# EAGLE design schematic_K3_Tuner (EAGLE 6.5.0)
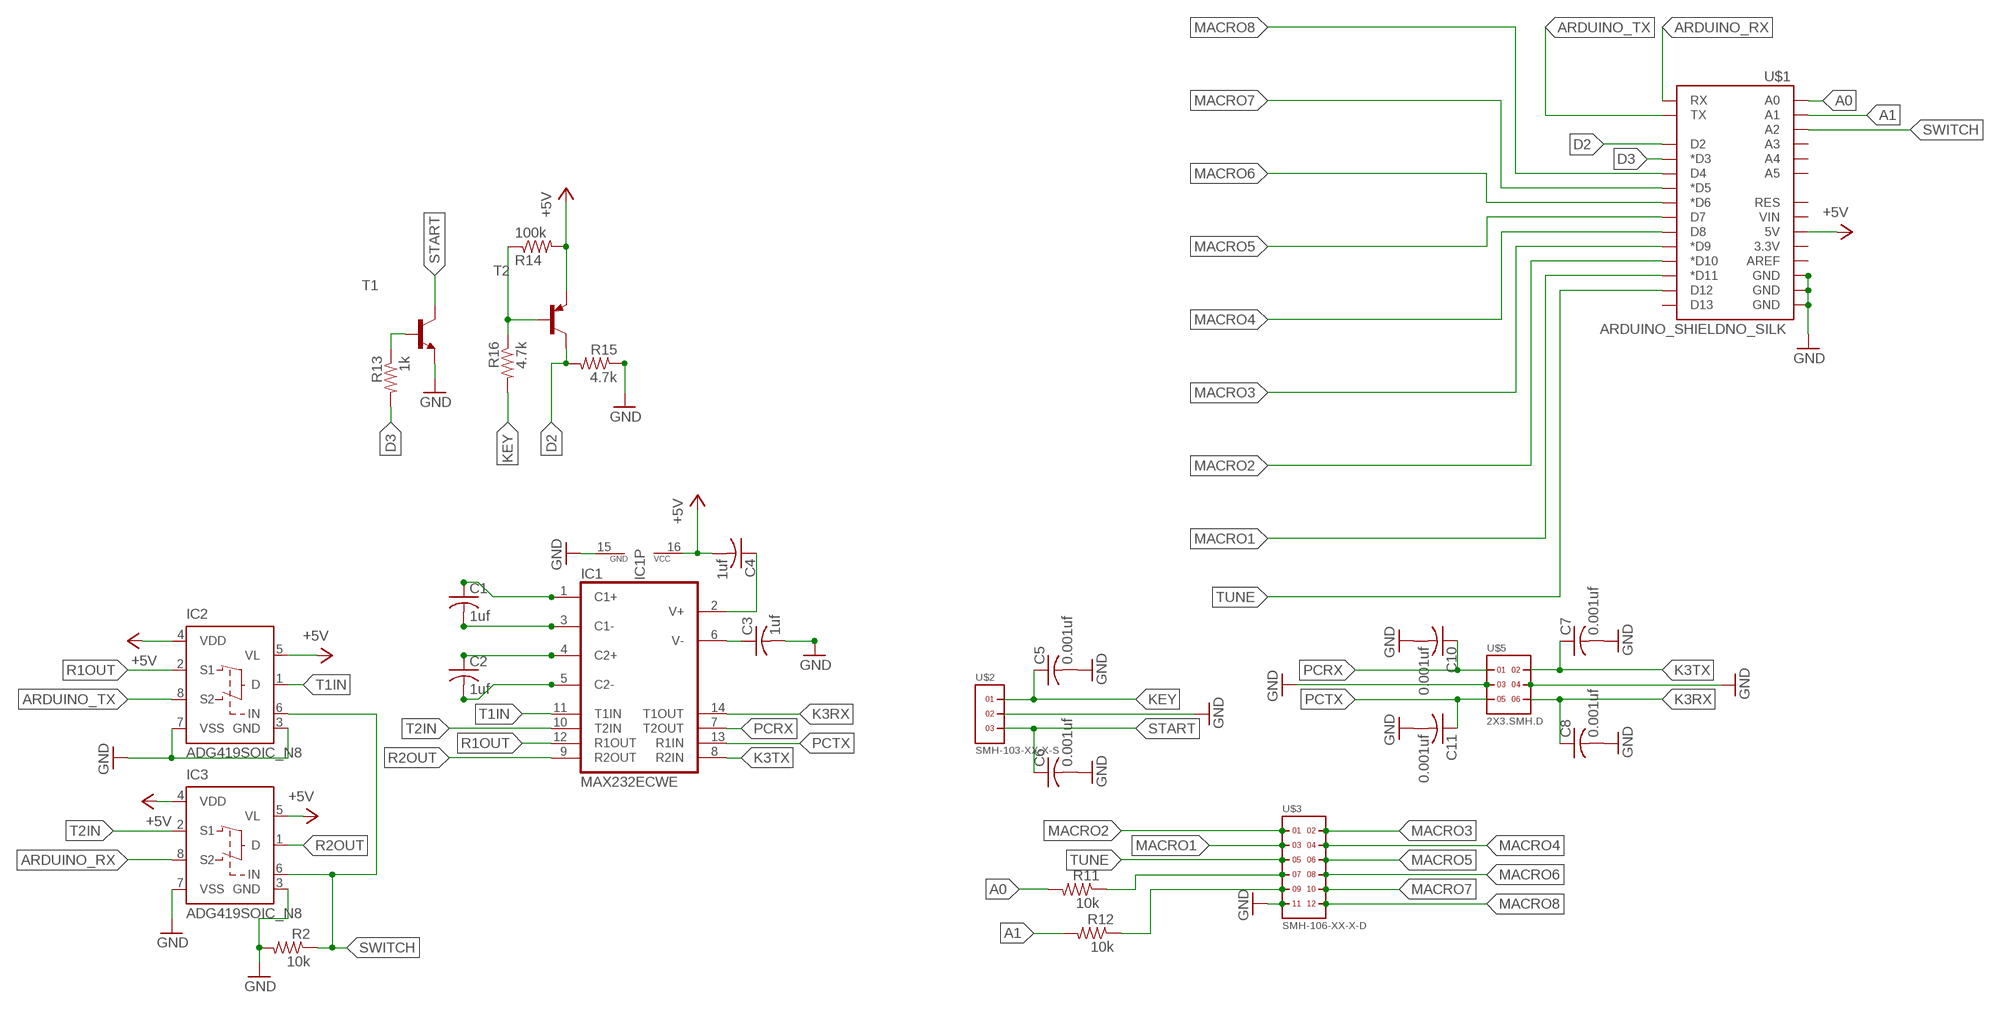
[diagram p0: schematic, sheet 1]

## Parts
C1  1uf  C-USC0805  [C0805]
C2  1uf  C-USC0805  [C0805]
C3  1uf  C-USC0805  [C0805]
C4  1uf  C-USC0805  [C0805]
C5  0.001uf  C-USC0805  [C0805]
C6  0.001uf  C-USC0805  [C0805]
C7  0.001uf  C-USC0805  [C0805]
C8  0.001uf  C-USC0805  [C0805]
C10  0.001uf  C-USC0805  [C0805]
C11  0.001uf  C-USC0805  [C0805]
IC1  MAX232ECWE  [SO16L]
IC2  ADG419SOIC_N8  [SOIC8]
IC3  ADG419SOIC_N8  [SOIC8]
R2  10k  R-US_M0805  [M0805]
R11  10k  R-US_M0805  [M0805]
R12  10k  R-US_M0805  [M0805]
R13  1k  R-US_M0805  [M0805]
R14  100k  R-US_M0805  [M0805]
R15  4.7k  R-US_M0805  [M0805]
R16  4.7k  R-US_M0805  [M0805]
T1  MMBT3904LT1-NPN-SOT23-BEC  [SOT23-BEC]
T2  MMBT3906LT1-PNP-SOT23-BEC  [SOT23-BEC]
U$1  ARDUINO_SHIELDNO_SILK  [DUEMILANOVE_VIAS]
U$2  SMH-103-XX-X-S  [SMH-103-XX-X-S]
U$3  SMH-106-XX-X-D  [SMH-106-XX-X-D]
U$5  2X3.SMH.D  [SMH-103-XX-X-D]

## Nets
+5V: C4.2 IC1.16(VCC) IC2.4(VDD) IC2.5(VL) IC3.4(VDD) IC3.5(VL) R14.2 T2.E U$1.5V
A0: R11.2 U$1.A0
A1: R12.2 U$1.A1
ARDUINO_RX: IC3.8(S2) U$1.RX
ARDUINO_TX: IC2.8(S2) U$1.TX
D2: R15.2 T2.C U$1.D2
D3: R13.2 U$1.D3(*D3)
GND: C3.2 C5.2 C6.2 C7.2 C8.2 C10.2 C11.2 IC1.15(GND) IC2.3(GND) IC2.7(VSS) IC3.3(GND) IC3.7(VSS) R2.2 R15.1 T1.E U$1.GND@0(GND) U$1.GND@1(GND) U$1.GND@2(GND) U$2.2 U$3.11 U$5.3 U$5.4
K3RX: C8.1 IC1.14(T1OUT) U$5.6
K3TX: C7.1 IC1.8(R2IN) U$5.2
KEY: C5.1 R16.2 U$2.1
MACRO1: U$1.D11(*D11) U$3.3
MACRO2: U$1.D10(*D10) U$3.1
MACRO3: U$1.D9(*D9) U$3.2
MACRO4: U$1.D8 U$3.4
MACRO5: U$1.D7 U$3.6
MACRO6: U$1.D6(*D6) U$3.8
MACRO7: U$1.D5(*D5) U$3.10
MACRO8: U$1.D4 U$3.12
N$1: R11.1 U$3.7
N$2: R12.1 U$3.9
N$3: C2.2 IC1.5(C2-)
N$4: C2.1 IC1.4(C2+)
N$6: C1.2 IC1.3(C1-)
N$7: C1.1 IC1.1(C1+)
N$9: C3.1 IC1.6(V-)
N$11: R13.1 T1.B
N$18: R14.1 R16.1 T2.B
N$19: C4.1 IC1.2(V+)
PCRX: C10.1 IC1.7(T2OUT) U$5.1
PCTX: C11.1 IC1.13(R1IN) U$5.5
R1OUT: IC1.12(R1OUT) IC2.2(S1)
R2OUT: IC1.9(R2OUT) IC3.1(D)
START: C6.1 T1.C U$2.3
SWITCH: IC2.6(IN) IC3.6(IN) R2.1 U$1.A2
T1IN: IC1.11(T1IN) IC2.1(D)
T2IN: IC1.10(T2IN) IC3.2(S1)
TUNE: U$1.D12 U$3.5
Unconnected: U$1.3.3V U$1.A3 U$1.A4 U$1.A5 U$1.AREF U$1.D13 U$1.RES U$1.VIN

## Library data of the parts
C1-C8 C10 C11 = rcl:C-US: CAPACITOR, American symbol
IC1 = maxim:MAX232ECWE: RS232 TRANSCEIVER; MF: MAXIM; MPN: MAX232ECWE+; OC_FARNELL: 9724435; OC_NEWARK: 67K4440
IC2 IC3 = K3Library:ADG419: LC²MOS Precision Mini-DIP Analog switch Source: http://www.analog.com/UploadedFiles/Data_Sheets/ADG419.pdf
R2 R11-R16 = resistor:R-US_: RESISTOR, American symbol
T1 = transistor:*-NPN-: NPN Transistror BF959 corrected 2008.03.06
T2 = transistor:*-PNP-: PNP Transistror
U$1 = SparkFun-Boards:ARDUINO_SHIELD: Arduino shield footprint
U$2 = SAMTEC_Headers:SMH-103-XX-X-S
U$3 = SAMTEC_Headers:SMH-106-XX-X-D
U$5 = samtec_Headers_2:2X3

## Board
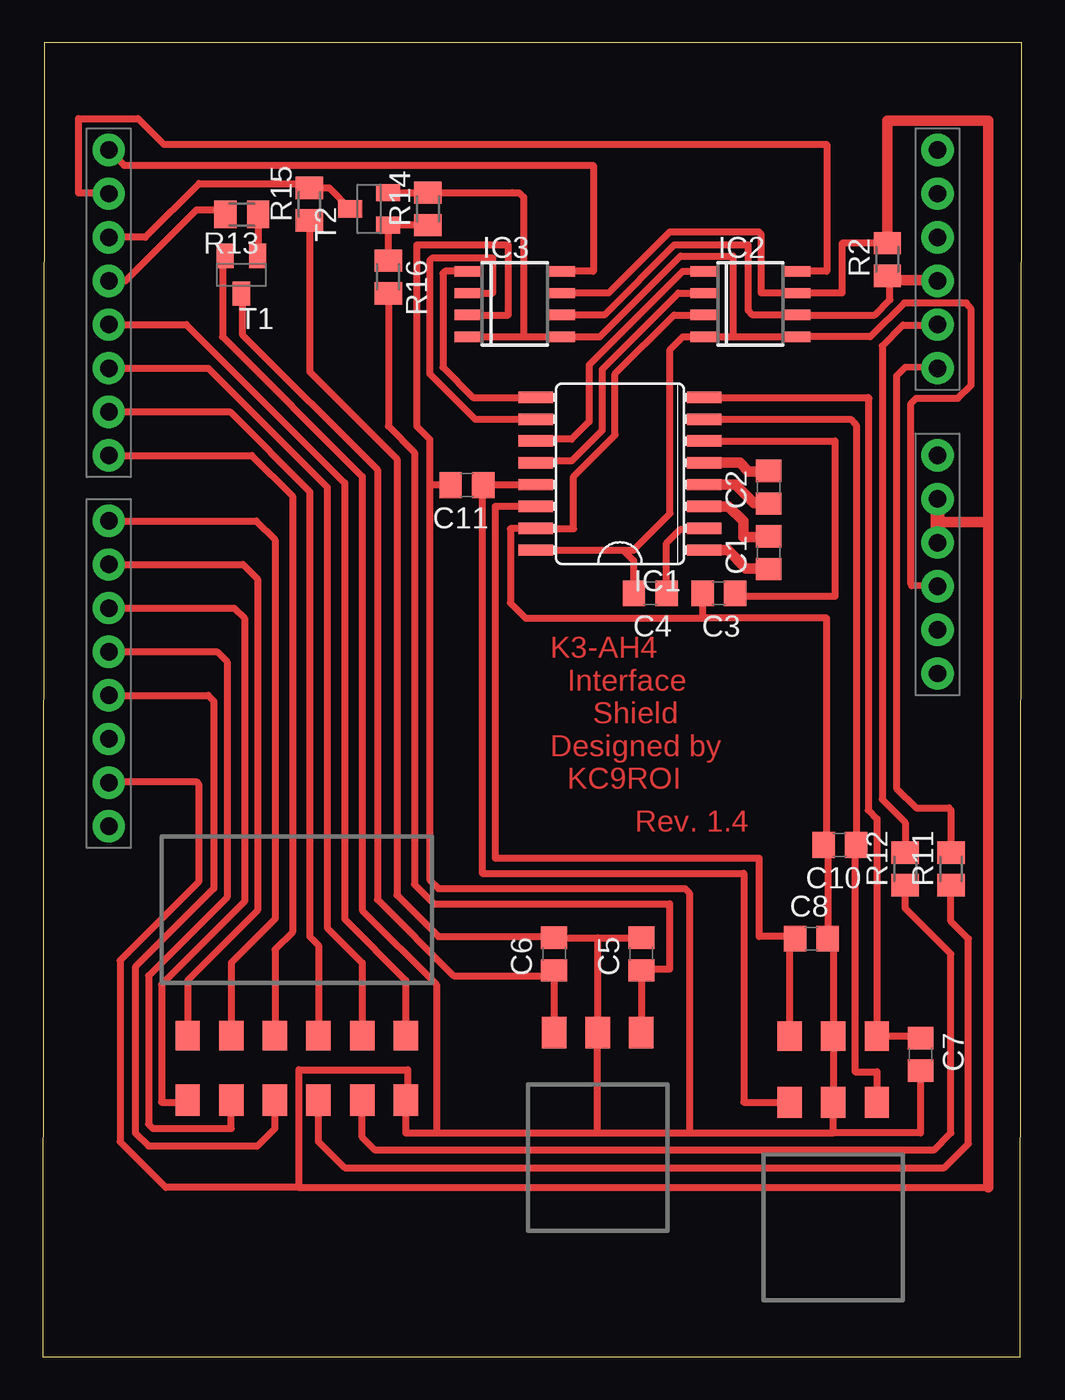
[diagram p1: board, top side]

Size 57.01 x 76.49 mm. Coordinates in mm from the lower left corner, seen from the top.
Outline: 0,0 56.92,0 57.01,76.49 0.09,76.49 0,0
Copper layers (1*16): Top 0.035mm / dielectric 1.5mm / Bottom 0.035mm
Design rules "default": minimum track width 10mil, minimum drill 24mil, track to track 8mil, track to pad 8mil, pad to pad 8mil, via to via 8mil, smd to smd 8mil, copper to edge 40mil, drill to drill 8mil, minimum pad ring 10mil, minimum via ring 8mil, stop-mask expansion 4mil, vias tented up to drill 0mil, thermal gap 10mil

### Footprints (pad centres in the part's own frame; a part is rotated, then mirrored left to right if it is on the bottom)
C0805 = smd 1.3 x 1.5: 1 -0.95,0; 2 0.95,0
SO16L = smd 0.66 x 2.032: 1 -4.445,-4.902; 2 -3.175,-4.902; 3 -1.905,-4.902; 4 -0.635,-4.902; 5 0.635,-4.902; 6 1.905,-4.902; 7 3.175,-4.902; 8 4.445,-4.902; 9 4.445,4.902; 10 3.175,4.902; 11 1.905,4.902; 12 0.635,4.902; 13 -0.635,4.902; 14 -1.905,4.902; 15 -3.175,4.902; 16 -4.445,4.902
SOIC8 = smd 0.6 x 1.5: 1 -1.905,-2.75; 2 -0.635,-2.75; 3 0.635,-2.75; 4 1.905,-2.75; 5 1.905,2.75; 6 0.635,2.75; 7 -0.635,2.75; 8 -1.905,2.75
M0805 = smd 1.3 x 1.6: 1 -0.95,0; 2 0.95,0
SOT23-BEC = smd 1 x 1.4: B -0.95,-1.1; C 0,1.1; E 0.95,-1.1
DUEMILANOVE_VIAS = drill 1.016 pad 1.88: 3.3V 50.8,13.97; 5V 50.8,16.51; A0 50.8,29.21; A1 50.8,31.75; A2 50.8,34.29; A3 50.8,36.83; A4 50.8,39.37; A5 50.8,41.91; AREF 2.54,2.54; D2 2.54,36.83; D3 2.54,34.29; D4 2.54,31.75; D5 2.54,29.21; D6 2.54,26.67; D7 2.54,24.13; D8 2.54,20.32; D9 2.54,17.78; D10 2.54,15.24; D11 2.54,12.7; D12 2.54,10.16; D13 2.54,7.62; GND@0 50.8,19.05; GND@1 50.8,21.59; GND@2 2.54,5.08; RES 50.8,11.43; RX 2.54,41.91; TX 2.54,39.37; VIN 50.8,24.13
SMH-103-XX-X-S = smd 1.422 x 1.829: 1 2.54,0; 2 0,0; 3 -2.54,0
SMH-106-XX-X-D = smd 1.422 x 1.829: 1 -6.35,-1.905; 3 -3.81,-1.905; 5 -1.27,-1.905; 7 1.27,-1.905; 9 3.81,-1.905; 11 6.35,-1.905 | smd 1.422 x 1.727: 2 -6.35,1.854; 4 -3.81,1.854; 6 -1.27,1.854; 8 1.27,1.854; 10 3.81,1.854; 12 6.35,1.854
SMH-103-XX-X-D = smd 1.422 x 1.829: 1 2.54,0; 3 0,0; 5 -2.54,0 | smd 1.422 x 1.727: 2 2.54,3.861; 4 0,3.861; 6 -2.54,3.861

### Placement (x,y rotation side)
C1  42.26,46.81 90 top
C2  42.26,50.62 90 top
C3  39.37,44.44 180 top
C4  35.37,44.45 180 top
C5  34.85,23.44 90 top
C6  29.77,23.44 90 top
C7  51.1,17.6 270 top
C8  44.75,24.33 0 top
C10  46.4,29.79 180 top
C11  24.69,50.74 180 top
IC1  33.6,51.4 90 top
IC2  41.2,61.28 270 top
IC3  27.48,61.28 270 top
R2  49.17,63.88 90 top
R11  52.88,28.39 90 top
R12  50.21,28.39 90 top
R13  11.58,66.49 180 top
R14  22.42,66.82 90 top
R15  15.52,67.1 90 top
R16  20.1,62.86 270 top
T1  11.55,62.99 180 top
T2  19,66.82 90 top
U$1  1.29,28.34 0 top
U$2  32.31,18.87 0 top
U$3  14.78,16.83 0 top
U$5  46.02,14.8 0 top

### Tracks (layer width: path | path; a pad name or v marks a point on that pad's centre or on a via)
+5V
  Top 0.406: IC3.4 27.99,59.38 | 27.99,59.38 IC3.5 32.43,59.38 37.13,64.08 40.18,64.08 40.18,59.37 | IC1.16 33.78,46.96 | 33.78,46.96 34.39,46.35 34.39,44.48 C4.2 | 33.78,46.96 34.39,46.96 36.52,49.09 36.52,58.64 37.26,59.38 IC2.4 38.5,59.37 40.18,59.37 | U$1.5V 50.62,44.9 | 50.62,44.9 50.54,44.98 50.54,55.49 50.85,55.8 53.29,55.8 54.05,56.56 54.05,60.98 53.78,61.35 50.15,61.35 48.18,59.38 IC2.5 40.18,59.37 | T2.E R14.2 | 50.59,44.88 50.62,44.9 | R14.2 27.34,67.77 | R14.2 27.73,67.76 27.99,67.51 27.99,59.38
A0
  Top 0.406: U$1.A0 50.21,57.6 49.7,57.09 49.7,33.09 50.85,31.95 52.75,31.95 52.88,31.82 R11.2 52.75,29.47
A1
  Top 0.406: U$1.A1 52.32,60.07 50.09,60.07 48.87,58.85 48.87,32.44 50.21,31.09 R12.2
ARDUINO_RX
  Top 0.406: IC3.8 32.05,63.19 32.05,69.36 4.72,69.36 U$1.RX
ARDUINO_TX
  Top 0.406: IC2.8 45.64,63.19 45.64,70.58 7.03,70.58 5.53,72.08 2.08,72.08 2.08,67.76 3.83,67.76 U$1.TX
D2
  Top 0.406: T2.C 16.67,68.05 R15.2 15.52,68.29 9.09,68.29 5.97,65.17 U$1.D2
D3
  Top 0.406: 10.6,66.47 R13.2 10.35,66.77 8.94,66.77 4.8,62.63 U$1.D3
GND
  Top 0.406: 28.7,48.33 IC1.15 28.72,48.2 | IC2.3 36.75,60.65 33.32,57.22 33.32,53.66 30.91,51.25 30.91,48.2 28.72,48.2 | R2.2 46.53,64.83 46.53,61.92 IC2.7 41.83,61.92 41.83,65.35 41.7,65.48 36.5,65.48 32.94,61.92 IC3.7 | C7.2 51.1,13.02 46.02,13.02 | 46.02,13.02 U$5.3 U$5.4 46.02,23.75 C8.2 45.7,29.53 C10.2 | 22.91,13.02 21.13,13.02 U$3.11 21.26,14.93 21.26,16.71 14.91,16.71 14.91,9.85 | 32.31,13.02 37.64,13.02 | 37.64,13.02 46.02,13.02 | U$1.GND@2 3.88,33.47 8.94,33.47 9.06,33.34 9.06,27.63 4.49,23.06 4.49,12.52 7.16,9.85 14.91,9.85 | T1.E 10.46,63.94 10.46,59.38 18.59,51.25 18.59,25.98 22.91,21.66 22.91,13.02 | R15.1 15.54,66.12 15.54,57.35 20.62,52.27 20.62,26.87 23.03,24.45 29.7,24.45 C6.2 32.31,24.39 | IC3.3 27.1,60.65 27.1,64.71 21.76,64.71 21.76,54.17 22.53,53.41 22.53,50.74 | 32.31,24.39 U$2.2 32.31,13.02 | 32.31,24.39 C5.2 | 22.91,13.02 32.31,13.02 | C11.2 22.53,50.74 | 28.72,48.2 27.23,48.2 27.23,43.89 28.11,43 38.42,43 | 22.53,50.74 22.53,27.76 23.03,27.25 37.39,27.25 37.64,26.99 37.64,13.02 | C10.2 | 38.42,43 C3.2 | C10.2 45.64,29.78 45.64,43 38.42,43 | 14.91,9.85 55.04,9.85 | U$1.GND@0 52.12,47.42 52.12,48.58
  Top 0.61: U$1.GND@0 52.14,47.44 | R2.2 49.17,71.95 55.04,71.95 55.04,48.58 | IC3.3 24.56,60.65 | 55.04,48.58 55.04,9.85 | 52.12,48.58 55.04,48.58
  Top 0.813: U$1.GND@1 U$1.GND@0
K3RX
  Top 0.406: 28.65,49.55 IC1.14 26.34,49.5 26.34,29.03 41.7,29.03 41.7,24.45 43.29,24.45 43.48,24.26 | 43.37,18.78 U$5.6 43.48,24.26 | C8.1 43.48,24.26
K3TX
  Top 0.406: IC1.8 48.05,55.85 48.1,55.8 48.05,55.75 48.05,31.82 48.56,31.31 U$5.2 50.48,18.66 C7.1 | 50.59,18.66 C7.1 | C7.1 50.74,18.55
KEY
  Top 0.406: R16.2 20.11,61.9 20.11,54.17 21.64,52.65 21.64,27.5 22.78,26.36 36.5,26.36 36.5,22.55 34.85,22.55 C5.1 | C5.1 U$2.1 | 34.78,22.42 C5.1
MACRO1
  Top 0.406: U$1.D11 10.13,41.04 10.72,40.46 10.72,26.74 6.14,22.17 6.14,13.53 6.4,13.28 10.97,13.28 U$3.3
MACRO2
  Top 0.406: U$1.D10 11.15,43.58 11.73,43 11.73,26.49 6.91,21.66 6.91,14.8 8.3,14.8 U$3.1
MACRO3
  Top 0.406: U$1.D9 11.66,46.12 12.49,45.28 12.49,25.98 8.43,21.91 U$3.2
MACRO4
  Top 0.406: U$1.D8 12.42,48.66 13.51,47.57 13.51,25.47 10.97,22.93 U$3.4
MACRO5
  Top 0.406: U$1.D7 12.16,52.47 14.53,50.11 14.53,24.71 13.51,23.69 U$3.6
MACRO6
  Top 0.406: U$1.D6 10.89,55.01 15.54,50.36 15.54,24.45 16.05,23.95 U$3.8
MACRO7
  Top 0.406: U$1.D5 9.62,57.55 16.56,50.62 16.56,24.96 18.59,22.93 U$3.10
MACRO8
  Top 0.406: U$1.D4 8.35,60.09 17.57,50.87 17.57,25.47 21.13,21.91 U$3.12
N$1
  Top 0.406: U$3.7 16.05,12.52 17.57,10.99 52.5,10.99 53.9,12.39 53.9,24.33 52.88,25.34 R11.1
N$2
  Top 0.406: U$3.9 18.59,12.77 19.35,12.01 51.86,12.01 52.88,13.02 52.88,23.44 50.21,26.11 R12.1
N$3
  Top 0.61: IC1.5 40.59,52.04 41.09,51.53 42.23,51.53 C2.2
N$4
  Top 0.61: IC1.4 40.33,50.77 41.4,49.7 42.23,49.7 C2.1
N$6
  Top 0.61: IC1.3 39.93,49.5 40.79,48.64 40.79,47.72 42.23,47.72 C1.2
N$7
  Top 0.61: IC1.1 39.87,46.96 40.94,45.89 42.23,45.89 C1.1
N$9
  Top 0.406: IC1.6 46.12,53.31 46.12,44.28 40.48,44.28 C3.1
  Top 0.61: 38.52,53.32 IC1.6
N$11
  Top 0.406: R13.1 12.53,64.11 T1.B
N$18
  Top 0.406: R14.1 T2.B 20.1,63.75 R16.1
N$19
  Top 0.406: C4.1 36.32,47.36 37.13,48.18 38.45,48.18 IC1.2
PCRX
  Top 0.406: IC1.7 47.04,54.58 47.29,54.32 47.29,54.3 47.35,54.24 C10.1 47.29,29.73 47.29,16.58 48.56,16.58 U$5.1
PCTX
  Top 0.406: 28.6,50.87 IC1.13 | 28.7,50.87 IC1.13 | IC1.13 28.67,50.74 C11.1 25.57,50.62 25.57,28.14 40.81,28.14 40.81,14.8 U$5.5
R1OUT
  Top 0.406: 29.26,52.14 28.8,52.14 IC1.12 | 28.75,51.99 IC1.12 | IC1.12 29.16,52.04 29.26,52.14 | 29.26,52.14 30.78,52.14 32.56,53.92 32.56,57.47 37,61.92 IC2.2
R2OUT
  Top 0.406: 28.75,55.8 IC1.9 | 28.65,55.8 IC1.9 | IC3.1 23.42,63.19 23.29,63.06 23.29,57.6 25.04,55.85 IC1.9
START
  Top 0.406: C6.1 U$2.3 | 29.7,22.42 C6.1 | 29.77,22.42 C6.1 | T1.C 11.6,61.84 11.6,59.51 19.48,51.63 19.48,26.61 23.92,22.17 29.45,22.17 C6.1
SWITCH
  Top 0.406: 49.41,62.68 R2.1 49.32,62.77 49.32,61.54 48.43,60.65 IC2.6 41.32,60.65 41.07,60.9 41.07,64.71 36.75,64.71 32.69,60.65 IC3.6
  Top 0.61: 49.41,62.68 52.09,62.68 U$1.A2
T1IN
  Top 0.406: 28.6,53.21 IC1.11 | 28.75,53.36 IC1.11 | IC1.11 28.8,53.41 30.78,53.41 31.8,54.43 31.8,57.73 37.26,63.19 IC2.1
T2IN
  Top 0.406: IC3.2 26.21,61.92 26.21,63.95 22.65,63.95 22.53,63.82 22.53,57.22 25.17,54.58 IC1.10
TUNE
  Top 0.406: U$1.D12 9.62,38.5 9.95,38.17 9.95,27.25 5.38,22.68 5.38,13.02 6.14,12.26 12.49,12.26 13.51,13.28 U$3.5

### Text on the board
Top: K3-AH4 / Interface / Shield / Designed by / KC9ROI | Rev. 1.4